# EAGLE schematic myboard (EAGLE 8.2.2)
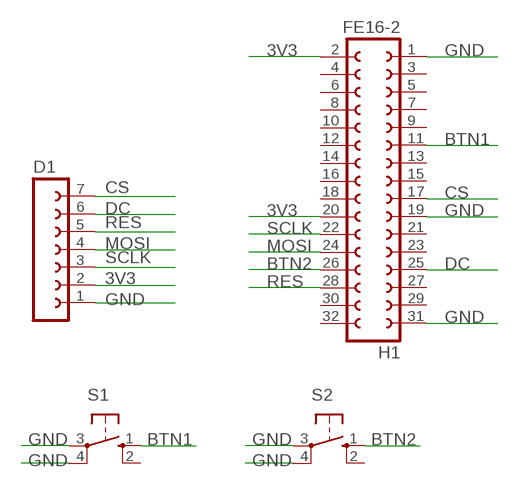
[diagram p0: schematic, sheet 1]

## Parts
D1  FE07-1  [FE07]
H1  FE16-2  [FE16-2]
S1  40-XX  [MY-B3F-40XX]
S2  40-XX  [MY-B3F-40XX]

## Nets
3V3: D1.2 H1.2 H1.20
BTN1: H1.11 S1.1(S)
BTN2: H1.26 S2.1(S)
CS: D1.7 H1.17
DC: D1.6 H1.25
GND: D1.1 H1.1 H1.19 H1.31 S1.3(P) S1.4(P1) S2.3(P) S2.4(P1)
MOSI: D1.4 H1.24
RES: D1.5 H1.28
SCLK: D1.3 H1.22
Unconnected: H1.3 H1.4 H1.5 H1.6 H1.7 H1.8 H1.9 H1.10 H1.12 H1.13 H1.14 H1.15 H1.16 H1.18 H1.21 H1.23 H1.27 H1.29 H1.30 H1.32 S1.2(S1) S2.2(S1)

## Library data of the parts
D1 = mylib:FE07-1: FEMALE HEADER
H1 = mylib:FE16-2
S1 S2 = mylib:40-XX: OMRON SWITCH